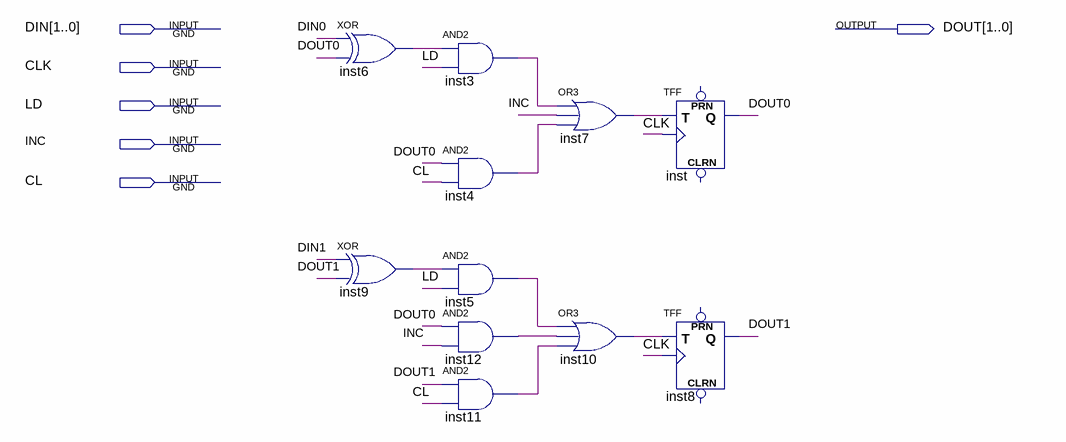
[diagram p0: schematic sheet]
// Quartus schematic REG2_LD_INC_CL.bdf as structural Verilog: 11 symbols, 6 pins
module REG2_LD_INC_CL (
  input  [1:0] DIN,
  input  CLK,
  input  LD,
  input  INC,
  input  CL,
  output [1:0] DOUT
);

  wire inst3_out, inst4_out, inst5_out, inst6_out, inst7_out, inst9_out, inst10_out, inst11_out, inst12_out;

  xor inst6 (inst6_out, DIN[0], DOUT[0]);
  xor inst9 (inst9_out, DIN[1], DOUT[1]);
  and inst3 (inst3_out, inst6_out, LD);
  and inst4 (inst4_out, DOUT[0], CL);
  and inst5 (inst5_out, inst9_out, LD);
  and inst12 (inst12_out, DOUT[0], INC);
  and inst11 (inst11_out, DOUT[1], CL);
  or inst7 (inst7_out, inst3_out, INC, inst4_out);
  or inst10 (inst10_out, inst5_out, inst12_out, inst11_out);
  TFF inst (.T(inst7_out), .CLK(CLK), .Q(DOUT[0]));  // open: PRN, CLRN
  TFF inst8 (.T(inst10_out), .CLK(CLK), .Q(DOUT[1]));  // open: PRN, CLRN
endmodule
